# EAGLE design gyro_board (EAGLE 6.6.0)
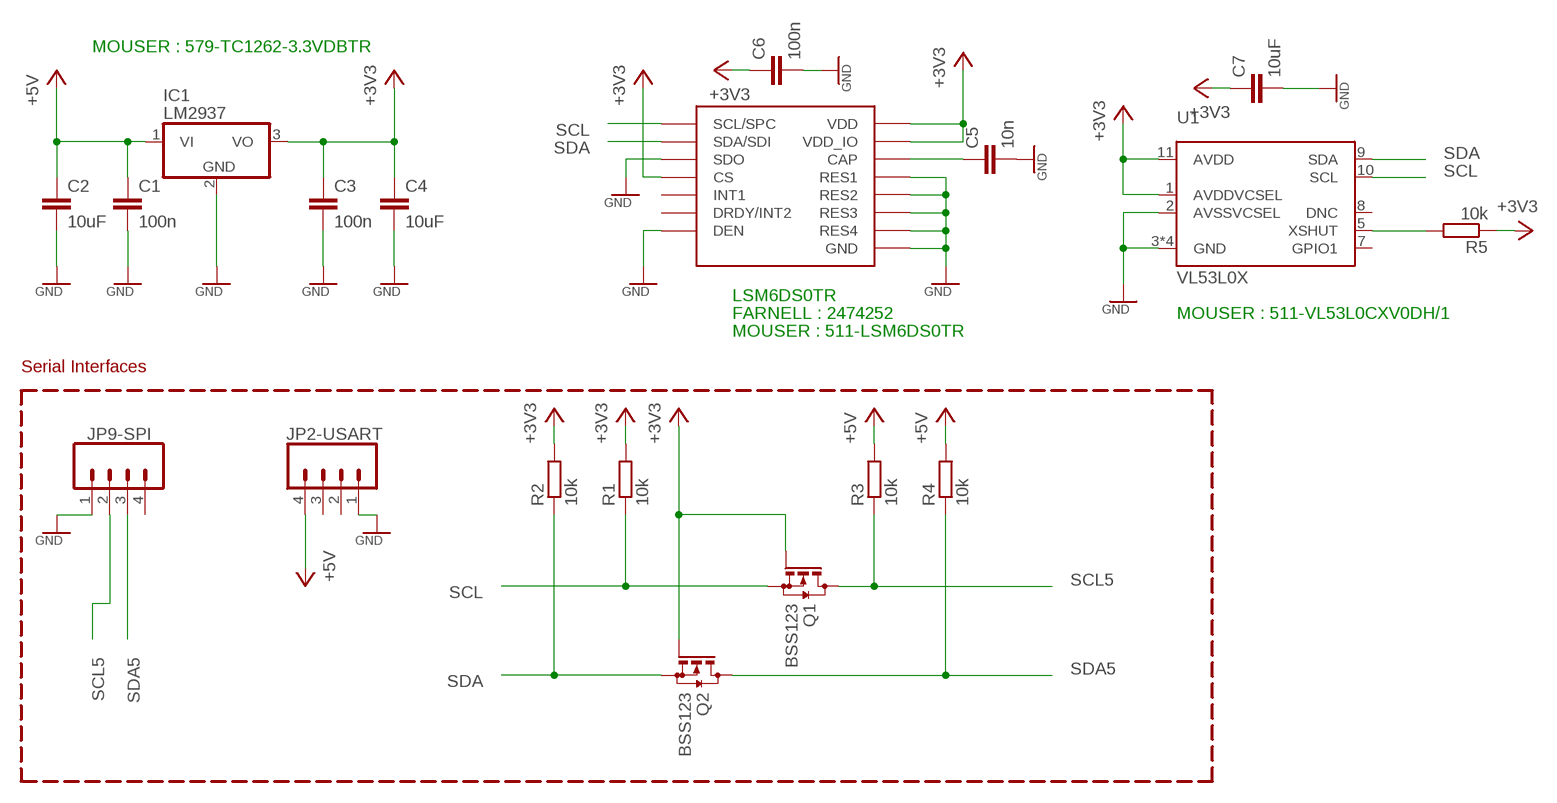
[diagram p0: schematic, sheet 1]

## Parts
C1  100n  C-EUC0805K  [C0805K]
C2  10uF  C-EUC0805K  [C0805K]
C3  100n  C-EUC0805K  [C0805K]
C4  10uF  C-EUC0805K  [C0805K]
C5  10n  C-EUC0805K  [C0805K]
C6  100n  C-EUC0805K  [C0805K]
C7  10uF  C-EUC0805K  [C0805K]
IC1  LM2937  [TO263-3]
JP2-USART  M04PTH  [1X04]
JP9-SPI  M04PTH  [1X04]
LSM6DS0TR  L3GD20H  [LGA16L]
Q1  BSS123  [SOT23]
Q2  BSS123  [SOT23]
R1  10k  R-EU_R0805  [R0805]
R2  10k  R-EU_R0805  [R0805]
R3  10k  R-EU_R0805  [R0805]
R4  10k  R-EU_R0805  [R0805]
R5  10k  R-EU_R0805  [R0805]
U1  VL53L0X  [VL53L0X]

## Nets
+3V3: C3.1 C4.1 C6.1 C7.1 IC1.3(VO) LSM6DS0TR.P$1(VDD_IO) LSM6DS0TR.P$5(CS) LSM6DS0TR.P$16(VDD) Q1.1(G) Q2.1(G) R1.2 R2.2 R5.1 U1.1(AVDDVCSEL) U1.11(AVDD)
+5V: C1.1 C2.1 IC1.1(VI) JP2-USART.4 R3.2 R4.2
GND [napajanie]: C1.2 C2.2 C3.2 C4.2 C5.2 C6.2 C7.2 IC1.2(GND) JP2-USART.1 JP9-SPI.1 LSM6DS0TR.P$4(SDO) LSM6DS0TR.P$8(DEN) LSM6DS0TR.P$9(RES1) LSM6DS0TR.P$10(RES2) LSM6DS0TR.P$11(RES3) LSM6DS0TR.P$12(GND) LSM6DS0TR.P$13(GND) LSM6DS0TR.P$15(RES4) U1.2(AVSSVCSEL) U1.3(GND) U1.4(GND) U1.6(GND) U1.12(GND)
N$1: C5.1 LSM6DS0TR.P$14(CAP)
N$2: R5.2 U1.5(XSHUT)
SCL: LSM6DS0TR.P$2(SCL/SPC) Q1.2(S) R1.1 U1.10(SCL)
SCL5: JP9-SPI.2 Q1.3(D) R3.1
SDA: LSM6DS0TR.P$3(SDA/SDI) Q2.2(S) R2.1 U1.9(SDA)
SDA5: JP9-SPI.3 Q2.3(D) R4.1
Unconnected: JP2-USART.2 JP2-USART.3 JP9-SPI.4 LSM6DS0TR.P$6(DRDY/INT2) LSM6DS0TR.P$7(INT1) U1.7(GPIO1) U1.8(DNC)

## Notes on the sheet
- MOUSER : 579-TC1262-3.3VDBTR
- LSM6DS0TR
- FARNELL : 2474252 | MOUSER : 511-VL53L0CXV0DH/1
- MOUSER : 511-LSM6DS0TR
- Serial Interfaces

## Library data of the parts
C1-C7 = resistor:C-EU: CAPACITOR, European symbol
IC1 = linear:LM2937: LM2937-2.5, LM2937-3.3 400mA and 500mA Voltage Regulators Source: http://cache.national.com/ds/LM/LM2937-2.5.pdf
JP2-USART JP9-SPI = yellow_car:M04: Header 4 Standard 4-pin 0.1" header. Use with straight break away headers (SKU : PRT-00116), right angle break away headers (PRT-00553), swiss pins (PRT-00743), machine pins (PRT-00117), and female headers (PRT-00115). Molex polarized connector foot print use with SKU : PRT-08231 with associated crimp pins and housings. 1MM SMD Version SKU: PRT-10208
LSM6DS0TR = main:L3GD20H
Q1 Q2 = transistor-small-signal:BSS123: N-CHANNEL MOS FET
R1-R5 = resistor:R-EU_: RESISTOR, European symbol
U1 = VL53L0X:VL53L0X: VL53L0X distance sensor

## Net classes
0 default: width 0.305 mm, drill 1.092 mm, clearance 0.305 mm
1 napajanie: width 0.61 mm, drill 1.092 mm, clearance 0.305 mm to class 0, clearance 0.305 mm
2 mostik: width 0.203 mm, drill 0.584 mm, clearance 0.203 mm to class 0, clearance 0.203 mm to class 1, clearance 0.203 mm

## Board
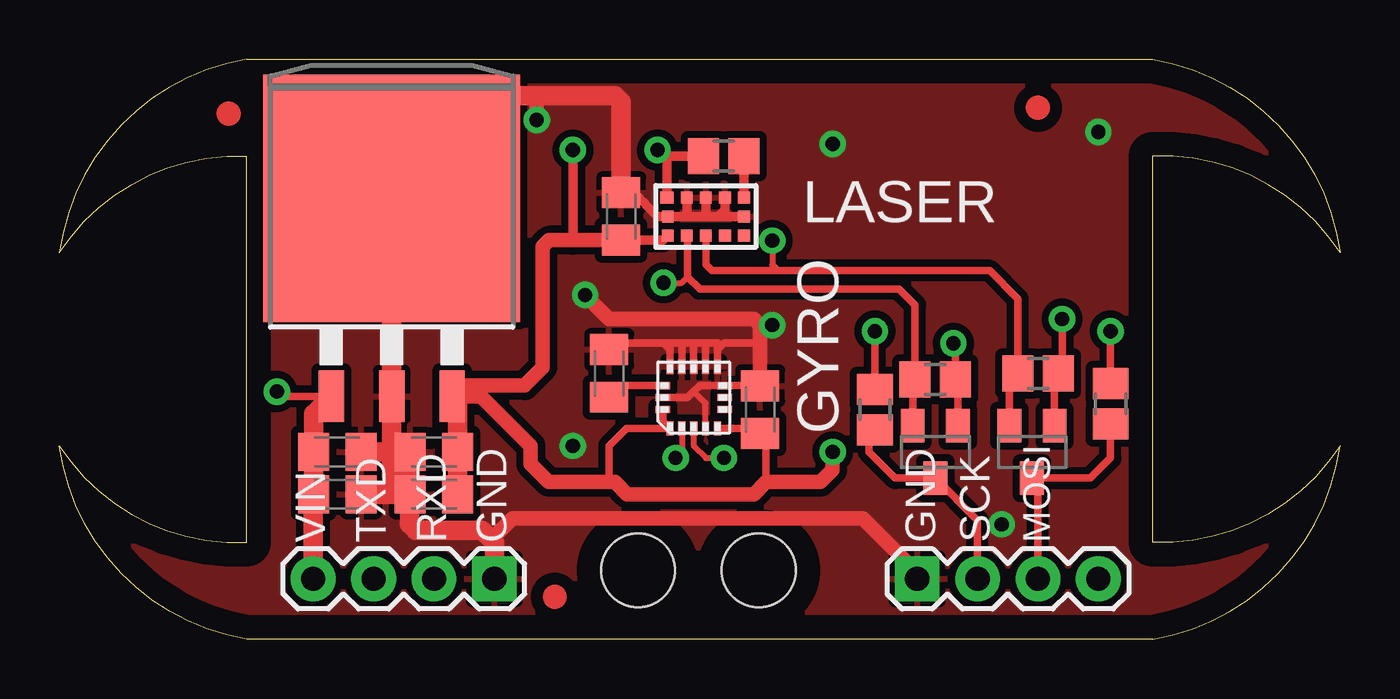
[diagram p1: board, top side]
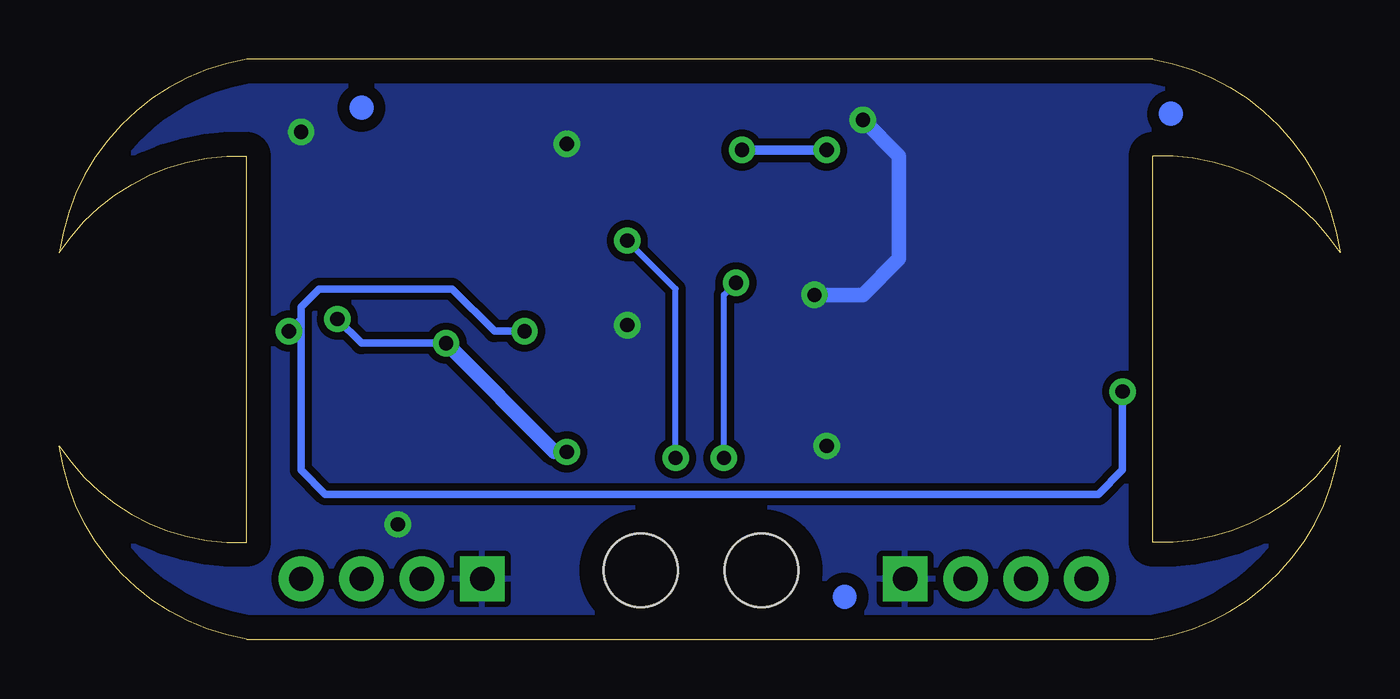
[diagram p2: board, bottom side, seen from below]

Size 53.85 x 24.38 mm. Coordinates in mm from the lower left corner, seen from the top.
Outline: 7.87,24.38 45.97,24.38 arc-73 53.85,16.26 arc59 45.97,20.32 45.97,4.06 arc59 53.85,8.13 arc-73 45.97,0 7.87,0 arc-73 0,8.13 arc59 7.87,4.06 7.87,20.32 arc59 0,16.26 arc-73 7.87,24.38
Copper layers (1*16): Top 0.035mm / dielectric 1.5mm / Bottom 0.035mm
Design rules "default *": minimum track width 12mil, minimum drill 5mil, track to track 10mil, track to pad 10mil, pad to pad 10mil, via to via 10mil, smd to smd 10mil, copper to edge 40mil, drill to drill 8mil, minimum pad ring 1mil, minimum via ring 10mil, stop-mask expansion 4mil, vias tented up to drill 0mil, thermal gap 10mil
Holes 3.1 mm at 24.32,2.9 29.4,2.9
tKeepout: area 20.6,47.2 to 23.1,52.3
tRestrict: area 20.6,47.2 to 23.1,52.3

### Footprints (pad centres in the part's own frame; a part is rotated, then mirrored left to right if it is on the bottom)
C0805K = smd 1.3 x 1.6: 1 -1,0; 2 1,0
TO263-3 = smd 1.067 x 2.159: 1 -2.54,-5.791; 2 0,-5.791; 3 2.54,-5.791 | smd 10.8 x 10.41: TAB 0,2.54
1X04 = drill 1.016 pad 1.88 square: 1 0,0 | drill 1.016 pad 1.88: 2 2.54,0; 3 5.08,0; 4 7.62,0
LGA16L = smd 0.6 x 0.3: P$1 -1.3,1; P$2 -1.3,0.5; P$3 -1.3,0; P$4 -1.3,-0.5; P$5 -1.3,-1; P$9 1.3,-1; P$10 1.3,-0.5; P$11 1.3,0; P$12 1.3,0.5; P$13 1.3,1 | smd 0.3 x 0.6: P$6 -0.5,-1.3; P$7 0,-1.3; P$8 0.5,-1.3; P$14 0.5,1.3; P$15 0,1.3; P$16 -0.5,1.3
SOT23 = smd 1 x 1.4: 1 -0.95,-1.1; 2 0.95,-1.1; 3 0,1.1
R0805 = smd 1.3 x 1.5: 1 -0.85,0; 2 0.85,0
VL53L0X = smd 0.5 x 0.58: 1 0.8,1.64 | smd 0.5 x 0.5: 2 0.8,0.8; 3 0.8,0; 4 0.8,-0.8; 5 0.8,-1.6; 6 0,-1.6; 7 -0.8,-1.6; 8 -0.8,-0.8; 9 -0.8,0; 10 -0.8,0.8; 11 -0.8,1.6; 12 0,1.6

### Placement (x,y rotation side)
C1  11.68,7.87 0 top
C2  11.68,6.1 0 top
C3  15.75,7.87 180 top
C4  15.75,6.1 180 top
C5  23.11,11.18 90 top
C6  29.46,9.65 90 top
C7  23.62,17.78 90 top
IC1  13.97,16 0 top
JP2-USART  18.29,2.54 180 top
JP9-SPI  36.07,2.54 0 top
LSM6DS0TR  26.67,10.16 90 top
Q1  36.83,7.87 180 top
Q2  40.89,7.87 180 top
R1  36.83,10.92 0 top
R2  41.15,11.18 0 top
R3  34.29,9.65 90 top
R4  44.2,9.91 90 top
R5  27.94,20.32 0 top
U1  27.18,17.78 90 top
U$1  [CIRCLE-1MM-2R]  41.15,22.35 0 top
U$2  [CIRCLE-1MM-2R]  7.11,22.1 0 top
U$3  [CIRCLE-1MM-2R]  20.83,1.78 0 top

### Tracks (layer width: path | path; a pad name or v marks a point on that pad's centre or on a via)
+3V3  (via drill 0.6)
  Top 0.305: Q2.1 41.84,11.02 R2.2 42.16,11.34 v42.16,13.46 | Q1.1 37.78,10.82 R1.2 37.68,12.36 v37.59,12.45 | LSM6DS0TR.P$16 25.37,9.16 LSM6DS0TR.P$1 23.85,8.86 23.11,8.13 23.11,6.86 22.86,6.6 | C6.1 29.26,8.86 LSM6DS0TR.P$5 29.24,8.86 29.72,8.38 29.72,6.6
  Top 0.406: C7.1 25.38,16.78 U1.11 | U1.1 25.54,20.18 | 25.54,20.18 v25.15,20.57 | v21.59,20.57 21.59,16.78 | R5.1 25.68,20.32 25.54,20.18
  Top 0.61: C7.1 21.59,16.78 20.59,16.78 20.32,16.51 20.32,11.43 19.56,10.67 16.97,10.67 IC1.3 17.73,10.21 19.81,8.13 19.81,7.37 20.57,6.6 22.86,6.6 23.37,6.6 23.88,6.1 29.21,6.1 29.72,6.6 32,6.6 32.51,7.11 v32.51,7.87
  Top 0.813: C4.1 C3.1 16.75,9.97 IC1.3
  Bottom 0.305: v37.59,12.45 41.15,12.45 v42.16,13.46
  Bottom 0.406: v25.15,20.57 v21.59,20.57
  Bottom 0.61: v32.51,7.87 33.02,7.87 v37.59,12.45
+5V  (via drill 0.6)
  Top 0.305: R3.2 v34.29,12.95 | v44.2,12.95 R4.2 | IC1.1 9.35,10.21 v9.14,10.41
  Top 0.813: JP2-USART.4 10.67,6.08 C2.1 C1.1 10.68,9.46 IC1.1
  Bottom 0.305: v9.14,10.41 9.14,7.11 10.16,6.1 42.67,6.1 43.69,7.11 43.69,13.46 | 43.69,13.46 43.69,13.97 42.93,14.73 37.34,14.73 35.56,12.95 v34.29,12.95 | v44.2,12.95 43.69,13.46
GND  (via drill 0.6)
  Top 0.254: LSM6DS0TR.P$4 27.17,9.91 26.67,10.41
  Top 0.305: 25.4,12.45 25.67,12.18 LSM6DS0TR.P$13 25.67,12.43 25.65,12.45 | C5.2 23.38,12.45 25.65,12.45 | LSM6DS0TR.P$15 26.42,10.16 26.67,10.41 26.92,10.67 LSM6DS0TR.P$8 29.46,10.66 C6.2 29.46,12.19 29.21,12.45 27.94,12.45 27.67,12.18 LSM6DS0TR.P$9 27.67,12.43 27.69,12.45 27.18,12.45 | 25.65,12.45 26.16,12.45 | 26.16,12.45 26.67,12.45 | 26.67,12.45 27.18,12.45 | LSM6DS0TR.P$11 26.67,12.45 | LSM6DS0TR.P$10 27.17,12.44 27.18,12.45 | LSM6DS0TR.P$12 26.17,12.44 26.16,12.45
  Top 0.406: C7.2 23.64,18.8 24.13,18.8 25.15,17.78 U1.12 26.42,17.78 | 26.42,17.78 27.18,17.78 | 27.18,17.78 27.69,17.78 | 27.69,17.78 U1.6 | U1.2 26.38,17.82 26.42,17.78 | U1.3 27.18,17.78 | U1.4 27.98,18.07 27.69,17.78
  Top 0.61: C6.2 29.46,13.21 29.21,13.46 23.11,13.46 v22.1,14.48 | v20.07,21.84 20.07,22.86 | JP9-SPI.1 36.07,2.79 33.78,5.08 19.05,5.08 18.16,4.19
  Top 0.813: 14.36,6.49 13.97,6.87 IC1.2 13.97,20.83 16,22.86 20.07,22.86 23.37,22.86 23.62,22.61 C7.2 | 14.36,6.49 C4.2 | C1.2 C3.2 C4.2 | C2.2 13.97,6.1 14.36,6.49 | JP2-USART.1 18.29,4.06 18.16,4.19 17.78,4.57 14.99,4.57 14.73,4.83 14.73,6.08 C4.2
  Bottom 0.61: v22.1,14.48 20.07,14.48 18.54,16 18.54,20.32 v20.07,21.84
  other vias: 29.97,13.21 32.51,20.83 43.69,21.34 21.59,8.13 39.62,4.83
  pour Top: -17.53,24.89 68.58,25.91 67.31,-7.11 -18.8,-8.13
  pour Bottom: -8.64,25.4 91.44,25.4 91.44,-16 -8.64,-16
N$1
  Top 0.305: LSM6DS0TR.P$14 23.6,10.66 C5.1
N$2
  Top 0.406: U1.5 28.78,20.31 R5.2
SCL  (via drill 0.6)
  Top 0.254: LSM6DS0TR.P$2 26.17,7.88 v25.91,7.62 | v25.4,14.99 26.16,14.99 26.42,15.24
  Top 0.305: Q1.2 35.88,10.82 R1.1 35.98,14.06 35.31,14.73 26.92,14.73 26.42,15.24 26.42,16.94 U1.10
  Bottom 0.254: v25.91,7.62 25.91,14.48 v25.4,14.99
SCL5
  Top 0.305: JP9-SPI.2 38.61,5 Q1.3 35.14,6.77 34.04,7.87 34.04,8.55 R3.1
SDA  (via drill 0.6)
  Top 0.254: LSM6DS0TR.P$3 26.67,8.13 27.18,7.62 v27.94,7.62 | v29.97,16.76 29.97,15.75 30.23,15.49
  Top 0.305: Q2.2 39.94,10.82 R2.1 40.3,14.31 39.12,15.49 30.23,15.49 27.43,15.49 27.18,15.75 U1.9
  Bottom 0.254: v27.94,7.62 27.94,14.73 v29.97,16.76
SDA5
  Top 0.305: JP9-SPI.3 41.15,6.52 Q2.3 43.35,6.77 44.2,7.62 R4.1

### Text on the board
tNames: LASER | GYRO | VIN | TXD | RXD | GND | GND | SCK | MOSI